# Altium project User_Interface.PrjPcb
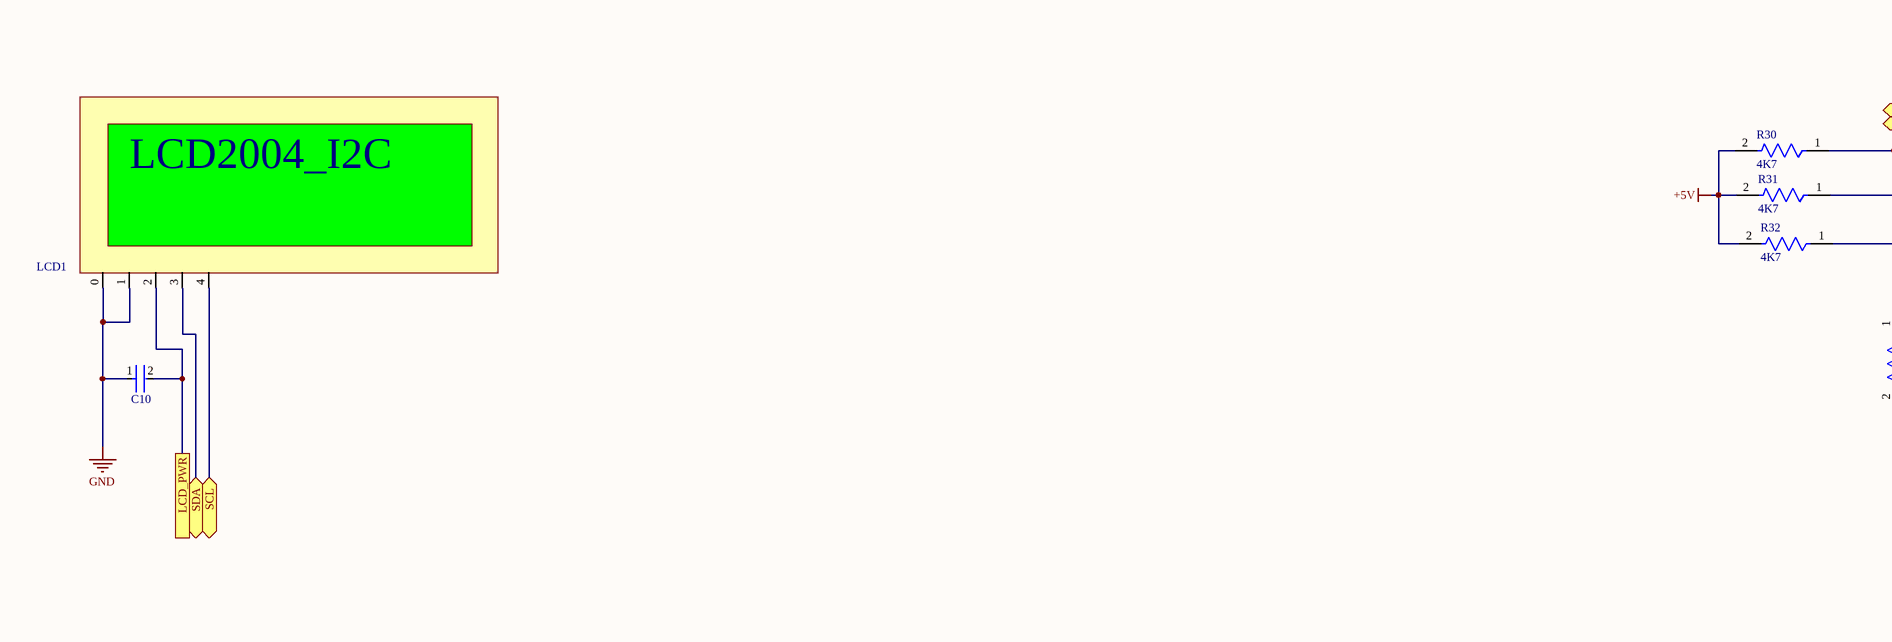
[diagram p0: User_Interface.SchDoc, top left]
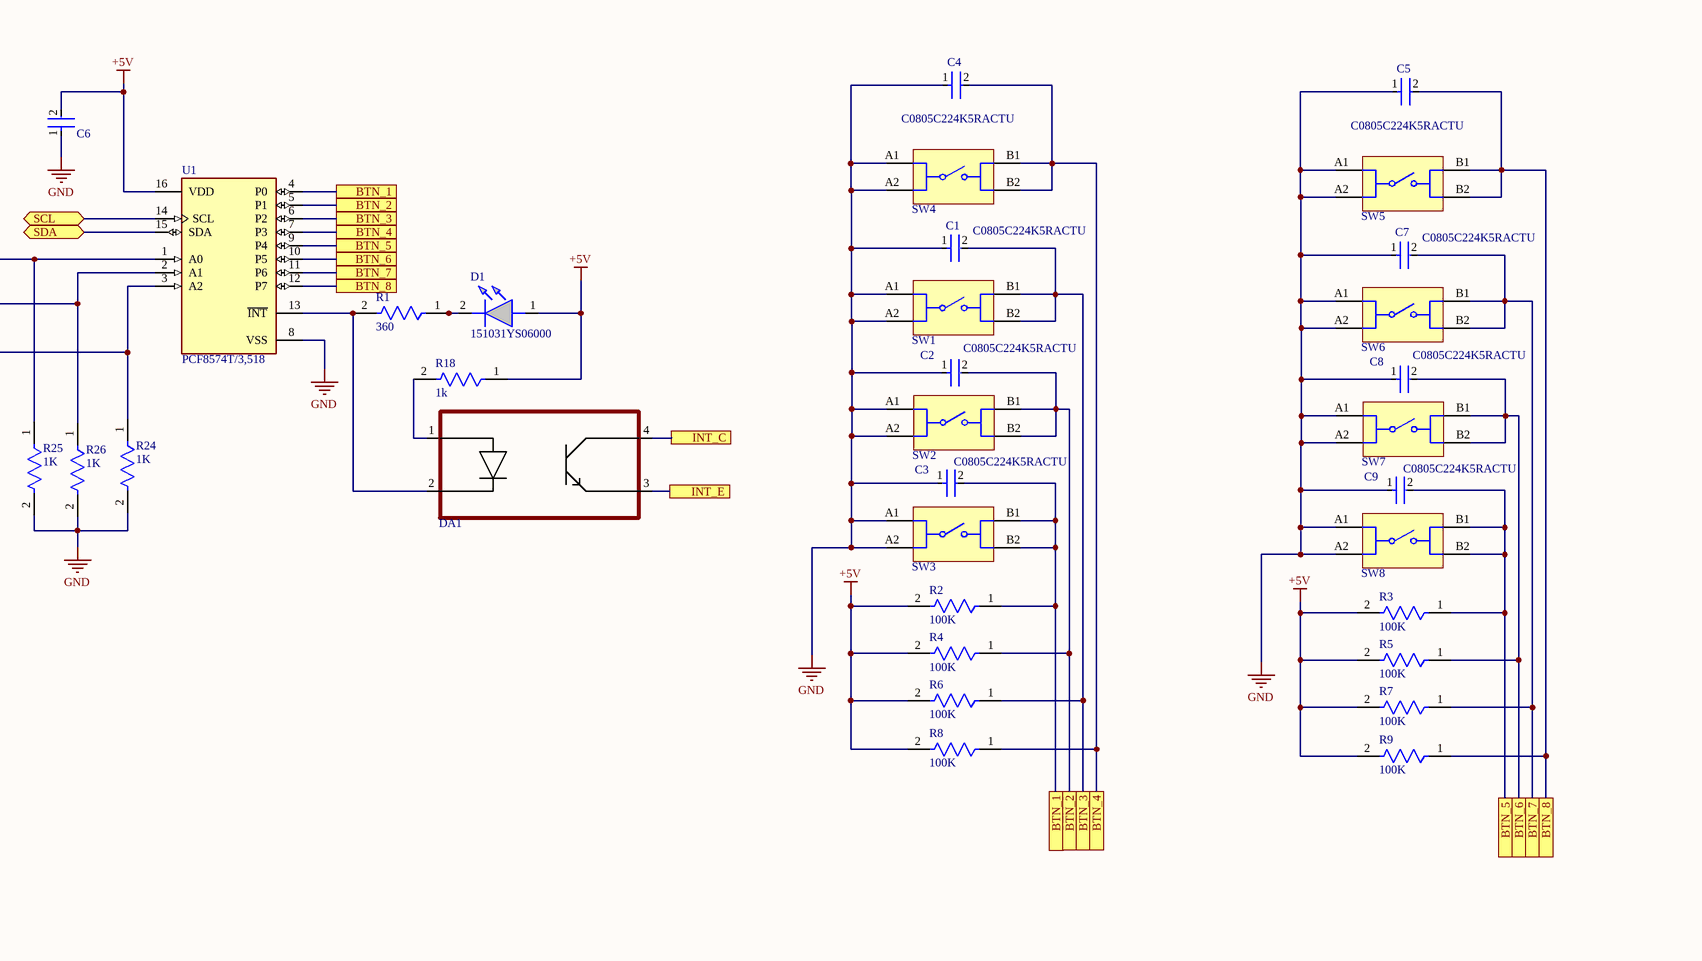
[diagram p1: User_Interface.SchDoc, top right]
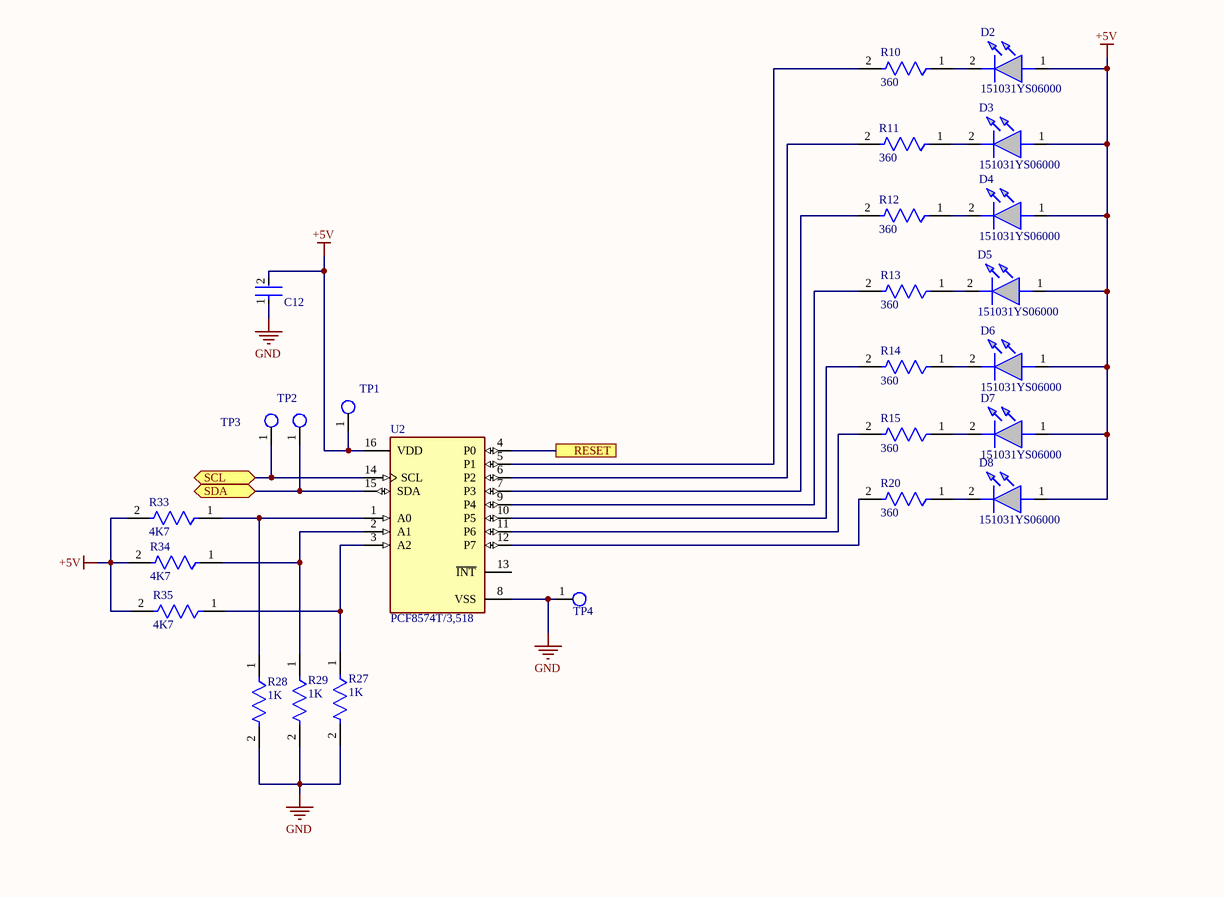
[diagram p2: User_Interface.SchDoc, bottom left]
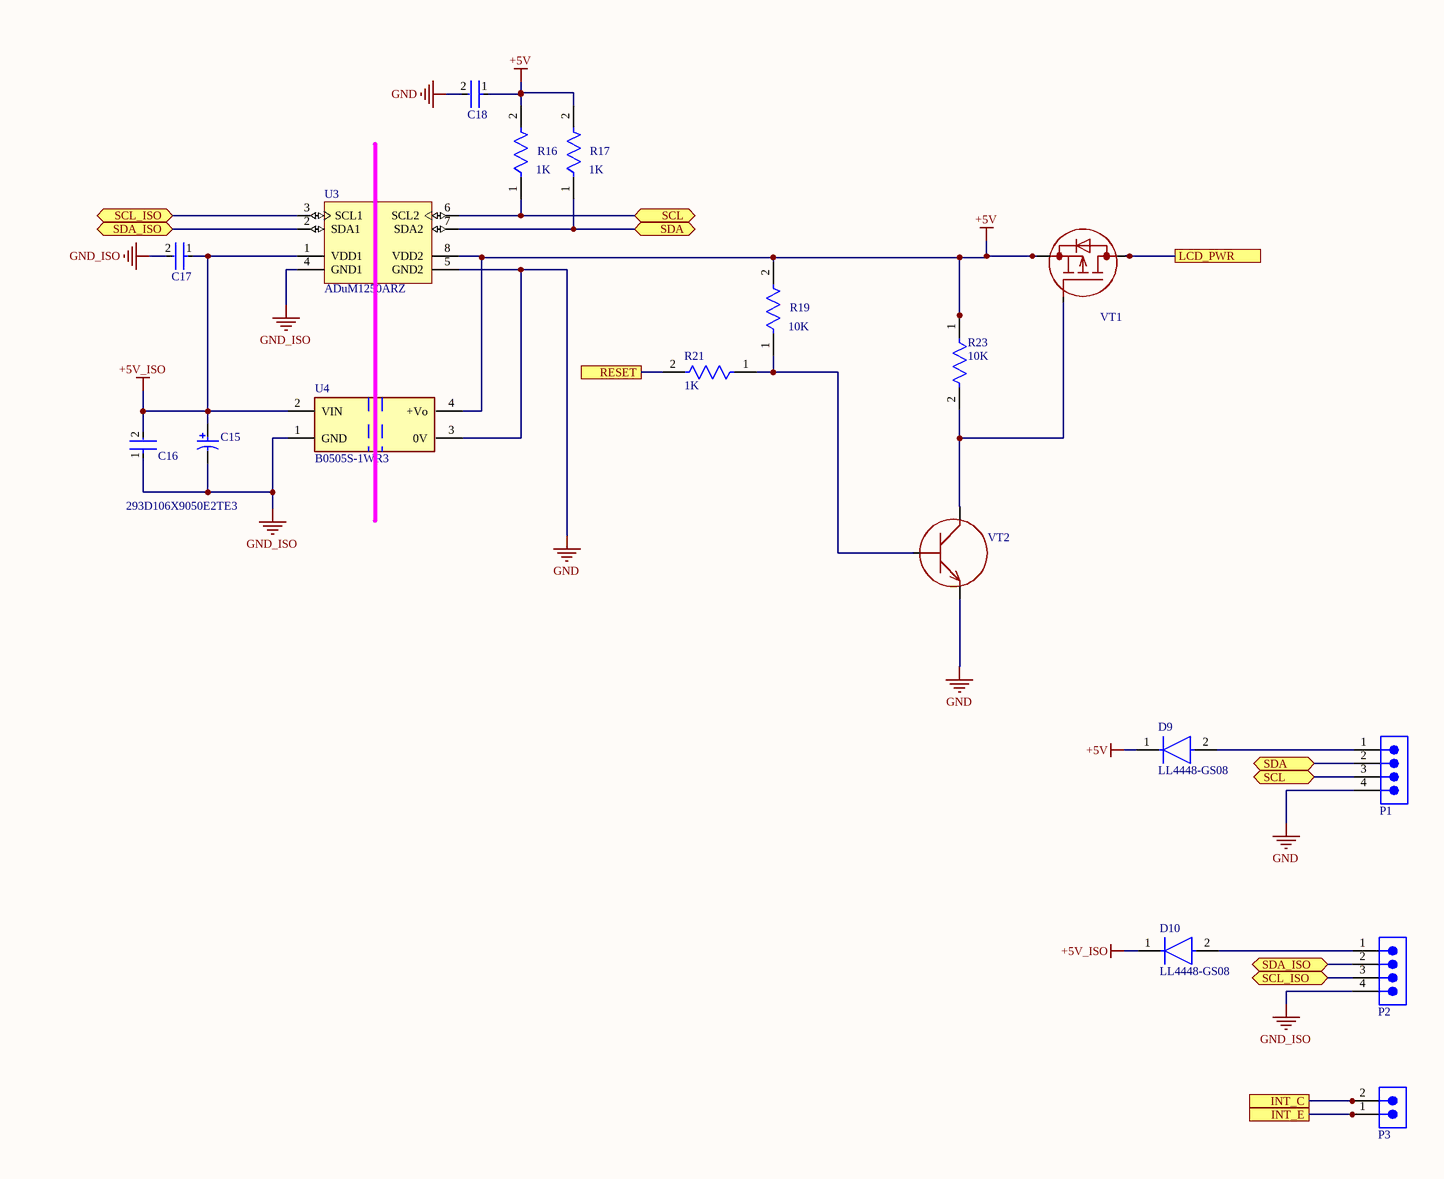
[diagram p3: User_Interface.SchDoc, bottom right]
1 sheet, 82 parts. Net scope: flat (ports and power ports of the same name join across sheets).
Board file: User_Interface.PcbDoc

## Sheet User_Interface.SchDoc
size A1; SheetNumber: 1; SheetTotal: 1

### Parts
C1  C0805C224K5RACTU  [FP-C0805C-DN-IPC_A]
C2  C0805C224K5RACTU  [FP-C0805C-DN-IPC_A]
C3  C0805C224K5RACTU  [FP-C0805C-DN-IPC_A]
C4  C0805C224K5RACTU  [FP-C0805C-DN-IPC_A]
C5  C0805C224K5RACTU  [FP-C0805C-DN-IPC_A]
C6  C0805C224K5RACTU  [FP-C0805C-DN-IPC_A]  (value not drawn)
C7  C0805C224K5RACTU  [FP-C0805C-DN-IPC_A]
C8  C0805C224K5RACTU  [FP-C0805C-DN-IPC_A]
C9  C0805C224K5RACTU  [FP-C0805C-DN-IPC_A]
C10  C0805C224K5RACTU  [FP-C0805C-DN-IPC_A]  (value not drawn)
C12  C0805C224K5RACTU  [FP-C0805C-DN-IPC_A]  (value not drawn)
C15  293D106X9050E2TE3  [VISH-293D-E_L]
C16  C0805C224K5RACTU  [FP-C0805C-DN-IPC_A]  (value not drawn)
C17  C0805C224K5RACTU  [FP-C0805C-DN-IPC_A]  (value not drawn)
C18  C0805C224K5RACTU  [FP-C0805C-DN-IPC_A]  (value not drawn)
D1  151031YS06000  [LED_BLUE]
D2  151031YS06000  [LED_GREEN]
D3  151031YS06000  [LED_GREEN]
D4  151031YS06000  [LED_GREEN]
D5  151031YS06000  [LED_GREEN]
D6  151031YS06000  [LED_GREEN]
D7  151031YS06000  [LED_GREEN]
D8  151031YS06000  [LED_GREEN]
D9  LL4448-GS08  [FP-6_560-5005_01-4-MFG]
D10  LL4448-GS08  [FP-6_560-5005_01-4-MFG]
DA1  PC817  [4-SMD]  (value not drawn)
LCD1  2004_I2C  [LCD2004_I2C]  (value not drawn)
P1  61900411021  [61900411021]  (value not drawn)
P2  61900411021  [61900411021]  (value not drawn)
P3  61900211021  [61900211021]  (value not drawn)
R1  360  [FP-CRCW0805-e3-MFG]
R2  100K  [FP-CRCW0805-e3-MFG]
R3  100K  [FP-CRCW0805-e3-MFG]
R4  100K  [FP-CRCW0805-e3-MFG]
R5  100K  [FP-CRCW0805-e3-MFG]
R6  100K  [FP-CRCW0805-e3-MFG]
R7  100K  [FP-CRCW0805-e3-MFG]
R8  100K  [FP-CRCW0805-e3-MFG]
R9  100K  [FP-CRCW0805-e3-MFG]
R10  360  [FP-CRCW0805-e3-MFG]
R11  360  [FP-CRCW0805-e3-MFG]
R12  360  [FP-CRCW0805-e3-MFG]
R13  360  [FP-CRCW0805-e3-MFG]
R14  360  [FP-CRCW0805-e3-MFG]
R15  360  [FP-CRCW0805-e3-MFG]
R16  1K  [Vishay_CRCW0805-e3_IPC_A]
R17  1K  [Vishay_CRCW0805-e3_IPC_A]
R18  1k  [FP-CRCW0805-e3-MFG]
R19  10K  [Vishay_CRCW0805-e3_IPC_A]
R20  360  [FP-CRCW0805-e3-MFG]
R21  1K  [Vishay_CRCW0805-e3_IPC_A]
R23  10K  [Vishay_CRCW0805-e3_IPC_A]
R24  1K  [Vishay_CRCW0805-e3_IPC_A]
R25  1K  [Vishay_CRCW0805-e3_IPC_A]
R26  1K  [Vishay_CRCW0805-e3_IPC_A]
R27  1K  [Vishay_CRCW0805-e3_IPC_A]
R28  1K  [Vishay_CRCW0805-e3_IPC_A]
R29  1K  [Vishay_CRCW0805-e3_IPC_A]
R30  4K7  [Vishay_CRCW0805-e3_IPC_A]
R31  4K7  [Vishay_CRCW0805-e3_IPC_A]
R32  4K7  [Vishay_CRCW0805-e3_IPC_A]
R33  4K7  [Vishay_CRCW0805-e3_IPC_A]
R34  4K7  [Vishay_CRCW0805-e3_IPC_A]
R35  4K7  [Vishay_CRCW0805-e3_IPC_A]
SW1  430156043726  [4301x60437x6]  (value not drawn)
SW2  430156043726  [4301x60437x6]  (value not drawn)
SW3  430156043726  [4301x60437x6]  (value not drawn)
SW4  430156043726  [4301x60437x6]  (value not drawn)
SW5  430156043726  [4301x60437x6]  (value not drawn)
SW6  430156043726  [4301x60437x6]  (value not drawn)
SW7  430156043726  [4301x60437x6]  (value not drawn)
SW8  430156043726  [4301x60437x6]  (value not drawn)
TP1  Test_Point_PCB  [Test_Point]  (value not drawn)
TP2  Test_Point_PCB  [Test_Point]  (value not drawn)
TP3  Test_Point_PCB  [Test_Point]  (value not drawn)
TP4  Test_Point_PCB  [Test_Point]  (value not drawn)
U1  PCF8574T/3,518  [FP-SOT162-1-MFG]
U2  PCF8574T/3,518  [FP-SOT162-1-MFG]
U3  ADuM1250ARZ  [ADI-R-8_N]
U4  B0505S-1WR3  [FP-B0505S-1WR3-MFG]
VT1  MOSFET-P-CH  [SOT23-3]  (value not drawn)
VT2  BC847-BEC  [SOT23-3]  (value not drawn)

### Ports
BTN_1, BTN_2, BTN_3, BTN_4, BTN_5, BTN_6, BTN_7, BTN_8, INT_C, INT_E, LCD_PWR, RESET, SCL (bidir), SCL_ISO (bidir), SDA (bidir), SDA_ISO (bidir)

### Nets
+5V: C6.2 C12.2 C18.1 D1.1(A) D2.1(A) D3.1(A) D4.1(A) D5.1(A) D6.1(A) D7.1(A) D8.1(A) D9.1(C) R2.2 R3.2 R4.2 R5.2 R6.2 R7.2 R8.2 R9.2 R16.2 R17.2 R18.1 R19.2 R23.1 R30.2 R31.2 R32.2 R33.2 R34.2 R35.2 TP1.1(G9) U1.16(VDD) U2.16(VDD) U3.8(VDD2) U4.4(+Vo) VT1.2(S)
+5V_ISO: C15.1 C16.2 C17.1 D10.1(C) U3.1(VDD1) U4.2(VIN)
GND: C1.1 C2.1 C3.1 C4.1 C5.1 C6.1 C7.1 C8.1 C9.1 C10.1 C12.1 C18.2 LCD1.0 LCD1.1 P1.4 R24.2 R25.2 R26.2 R27.2 R28.2 R29.2 SW1.A1 SW1.A2 SW2.A1 SW2.A2 SW3.A1 SW3.A2 SW4.A1 SW4.A2 SW5.A1 SW5.A2 SW6.A1 SW6.A2 SW7.A1 SW7.A2 SW8.A1 SW8.A2 TP4.1(G9) U1.8(VSS) U2.8(VSS) U3.5(GND2) U4.3(0V) VT2.2(E)
GND_ISO: C15.2 C16.1 C17.2 P2.4 U3.4(GND1) U4.1(GND)
NetC1_2: C1.2 R6.1 SW1.B1 SW1.B2 U1.6(P2) ; port BTN_3
NetC2_2: C2.2 R4.1 SW2.B1 SW2.B2 U1.5(P1) ; port BTN_2
NetC3_2: C3.2 R2.1 SW3.B1 SW3.B2 U1.4(P0) ; port BTN_1
NetC4_2: C4.2 R8.1 SW4.B1 SW4.B2 U1.7(P3) ; port BTN_4
NetC5_2: C5.2 R9.1 SW5.B1 SW5.B2 U1.12(P7) ; port BTN_8
NetC7_2: C7.2 R7.1 SW6.B1 SW6.B2 U1.11(P6) ; port BTN_7
NetC8_2: C8.2 R5.1 SW7.B1 SW7.B2 U1.10(P5) ; port BTN_6
NetC9_2: C9.2 R3.1 SW8.B1 SW8.B2 U1.9(P4) ; port BTN_5
NetC10_2: C10.2 LCD1.2 VT1.3(D) ; port LCD_PWR
NetD1_2: D1.2(K) R1.1
NetD2_2: D2.2(K) R10.1
NetD3_2: D3.2(K) R11.1
NetD4_2: D4.2(K) R12.1
NetD5_2: D5.2(K) R13.1
NetD6_2: D6.2(K) R14.1
NetD7_2: D7.2(K) R15.1
NetD8_2: D8.2(K) R20.1
NetD9_2: D9.2(A) P1.1
NetD10_2: D10.2(A) P2.1
NetDA1_1: DA1.1(ANODE) R18.2
NetDA1_2: DA1.2(CATHODE) R1.2 U1.13(~{INT})
NetDA1_3: DA1.3(EMITTER) P3.1 ; port INT_E
NetDA1_4: DA1.4(COLLECTOR) P3.2 ; port INT_C
NetLCD1_3: LCD1.3 P1.2 R17.1 TP2.1(G9) U1.15(SDA) U2.15(SDA) U3.7(SDA2) ; port SDA
NetLCD1_4: LCD1.4 P1.3 R16.1 TP3.1(G9) U1.14(SCL) U2.14(SCL) U3.6(SCL2) ; port SCL
NetP2_2: P2.2 U3.2(SDA1) ; port SDA_ISO
NetP2_3: P2.3 U3.3(SCL1) ; port SCL_ISO
NetR10_2: R10.2 U2.5(P1)
NetR11_2: R11.2 U2.6(P2)
NetR12_2: R12.2 U2.7(P3)
NetR13_2: R13.2 U2.9(P4)
NetR14_2: R14.2 U2.10(P5)
NetR15_2: R15.2 U2.11(P6)
NetR19_1: R19.1 R21.1 VT2.1(B)
NetR20_2: R20.2 U2.12(P7)
NetR21_2: R21.2 U2.4(P0) ; port RESET
NetR23_2: R23.2 VT1.1(G) VT2.3(C)
NetR24_1: R24.1 R32.1 U1.3(A2)
NetR25_1: R25.1 R30.1 U1.1(A0)
NetR26_1: R26.1 R31.1 U1.2(A1)
NetR27_1: R27.1 R35.1 U2.3(A2)
NetR28_1: R28.1 R33.1 U2.1(A0)
NetR29_1: R29.1 R34.1 U2.2(A1)

Not connected (* = marked no-connect by the designer): U2 13(~{INT})

### Library data of the parts
C1-C10 C12 C16-C18 = CMP-1036-04552-2: CAP CER 0.22UF 50V X7R 0805; Manufacturer: KEMET; Value: 0.22 μF; Temperature Coefficient: 30ppm/°C; Material: Ceramic; Tolerance: 0.1; ComponentLink2URL: https://content.kemet.com/datasheets/KEM_C1003_C0G_SMD.pdf; Temperature Characteristic: X7R; Device Class L3: Ceramic Capacitors; Lead Free: Yes; Temperature: -55°C to +125°C; RoHS: TRUE; Capacitance: 0.22 μF; Automotive: No; Octopart: https://octopart.com/c0805c224k5ractu-kemet-144670; Manufacturer Part Number: C0805C224K5RACTU; Temperature Range Low: -55°C; Height: 0.88mm; Device Class L1: Passive Components; Digikey Description: CAP CER 0.22UF 50V X7R 0805; ComponentLink2Description: Datasheet; Mouser Description: CAP CER 0.22UF 50V X7R 0805; Category: Cap; Ipc Land Pattern Name: CAPC200125X78; Temperature Range High: +125°C; Package: C0805C-DN; Device Class L2: Capacitors; Voltage Rating: 50 V
C15 = CMP-2000-05556-1: Tantalum Capacitor, 10 uF, +/- 10%, 50 V, -55 to 125 degC, 2-Pin SMD (7343-43), RoHS, Tape and Reel; Manufacturer: Vishay; Capacitance: 10000000pF; Product Height (mm): 4mm; Lead Spacing (nom): NotRequiredmm; Product Depth (mm): 4.3mm; Seal: NotRequired; Case Style: Molded; DELETED: Compliant; Voltage: 50VDC; Product Length (mm): 7.3mm; Polarity: Polar; ESR: 0.8ohm; DF: 6%; Rad Hardened: No; DCL: 5uA; Package Description: 2-Pin Surface Mount Device, Body 7.3 x 4.3 mm; Datasheet URL: http://www.vishay.com/docs/40002/293d.pdf; Operating Temp Range: -55Cto125C; Seated Plane Height: NotRequiredmm; Mounting Technology: SurfaceMount; Insulation: NotRequired; Failure Rate: NotRequired; Construction: SMTChip; Packaging: TapeandReel; Mounting Style: SurfaceMount; Tolerance (+ or -): 10%; Product Diameter (mm): NotRequiredmm; Length W/Weld (max): NotRequiredmm; Length W/Weld: NotRequiredmm; Case Code: E; Datasheet Version: 08/2016; Package Reference: 293D-E; Package / Case: 7343-43; Manufacturer URL: http://www.vishay.com/; Wire Form: NotRequired
D1-D8 = 151031YS06000: WURTH ELEKTRONIK - 151031YS06000 - LED, Yellow, Through Hole, T-1 (3mm), 30 mA, 2 V, 590 nm; Geometry.Height: 5.5mm; Manufacturer_Name: Wurth Elektronik; Manufacturer_Part_Number: 151031YS06000; Mouser Part Number: 710-151031YS06000; Mouser Price/Stock: https://www.mouser.co.uk/ProductDetail/Wurth-Elektronik/151031YS06000?qs=LlUlMxKIyB3xSYYW%252BcuBiQ%3D%3D; Arrow Part Number: *; Arrow Price/Stock: *; Mouser Testing Part Number: *; Mouser Testing Price/Stock: *; Datasheet Link: https://katalog.we-online.de/led/datasheet/151031YS06000.pdf
D9 D10 = CMP-249167-000001-1: DIODE GEN PURP 75V 150MA SOD80; Manufacturer: Vishay Small Signal; Max Junction Temp: +175°C; Automotive Grade: Grade 0; Capacitance: 4pF; Peak Reverse Current: 5uA; Forward Current: 300mA; Max Repetitive Reverse Voltage: 100V; Max Surge Forward Current: 2A; Value: 4pF; ComponentLink2Description: Datasheet; Height: 1.6mm; ComponentLink2URL: http://www.vishay.com/docs/85557/ll4148.pdf; Category: Diode; Lead Free: Yes; Device Class L3: Rectifier Diodes; Reverse Voltage: 75V; Mouser Description: Diodes - General Purpose, Power, Switching 100 Volt 100mA; RoHS: TRUE; Temperature: to +175°C; Automotive: Yes; Octopart: https://octopart.com/ll4448-gs08-vishay+small+signal-40886; Digikey Description: DIODE GEN PURP 75V 150MA SOD80; Manufacturer Part Number: LL4448-GS08; Temperature Range High: +175°C; Device Class L1: Discrete Semiconductors; Device Class L2: Diodes; Package: 6.560-5005.01-4
LCD1 = LCD2004_I2C
P1 P2 = 61900411021: WR-WTB THT Male Left Angled Bottom Locking Header, pitch 2.54mm, 4pins; Manufacturer: Wurth Elektronik; Contact Resistance: 20mΩ; Rated Current: 3A; Working Voltage: 250VAC; Withstanding Voltage: 1000VAC; ComponentLink1Description: Website Link; ComponentLink1URL: https://www.we-online.com/redexpert/article/61900411021?ad; ComponentLink2Description: Datasheet Link; ComponentLink2URL: https://www.we-online.com/redexpert/spec/61900411021?ad; Manufacturer Part Number: 61900411021; Category: Wire-to-Board Connectors; Match Code: WR-WTB; Mount: Through Hole; Operating Temperature Max: 105°C; Operating Temperature Min: -40°C; Packaging: Bag; Length: 10.16mm; Width: 12.47mm; Height: 5.8mm; Gender: Male; Number of Pins: 4; Number of Rows: 1; Orientation: Right Angled Bottom Locking; Pitch: 2.54mm
P3 = 61900211021: WR-WTB THT Male Left Angled Bottom Locking Header, pitch 2.54mm, 2pins; Manufacturer: Wurth Elektronik; Contact Resistance: 20mΩ; Rated Current: 3A; Working Voltage: 250VAC; Withstanding Voltage: 1000VAC; ComponentLink1Description: Website Link; ComponentLink1URL: https://www.we-online.com/redexpert/article/61900211021?ad; ComponentLink2Description: Datasheet Link; ComponentLink2URL: https://www.we-online.com/redexpert/spec/61900211021?ad; Manufacturer Part Number: 61900211021; Category: Wire-to-Board Connectors; Match Code: WR-WTB; Mount: Through Hole; Operating Temperature Max: 105°C; Operating Temperature Min: -40°C; Packaging: Bag; Length: 5.08mm; Width: 12.47mm; Height: 5.8mm; Gender: Male; Number of Pins: 2; Number of Rows: 1; Orientation: Right Angled Bottom Locking; Pitch: 2.54mm
R1 R10-R15 R18 R20 = CMP-2001-04908-2: RES Thick Film, 200Ω, 1%, 0.125W, 100ppm/°C, 0805; Resistance: 10kR; Voltage Rating (DC): 150V; Power Rating: 125mW; Weight: 0.000194oz; Package Quantity: 5000; Military Standard: Not; Max Operating Temperature: 155°C; Temperature Coefficient: 100ppm/°C; Contact Plating: Tin; Width: 1.25mm; Height: 0.45mm; Radiation Hardening: No; Tolerance: 1%; Min Operating Temperature: -55°C; Voltage Rating: 150V; Length: 2mm; Depth: 1.25mm; Termination: SMD/SMT; Packaging: Tape and Reel; Case/Package: 0805; Case Code (Metric): 2012; Lead Free: Lead Free; Case Code (Imperial): 0805; Composition: Thick Film
R2-R9 = CMP-2001-04908-2: RES Thick Film, 100kΩ, 1%, 0.125W, 100ppm/°C, 0805; Resistance: 10kR; Voltage Rating (DC): 150V; Power Rating: 125mW; Weight: 0.000194oz; Package Quantity: 5000; Military Standard: Not; Max Operating Temperature: 155°C; Temperature Coefficient: 100ppm/°C; Contact Plating: Tin; Width: 1.25mm; Height: 0.45mm; Radiation Hardening: No; Tolerance: 1%; Min Operating Temperature: -55°C; Voltage Rating: 150V; Length: 2mm; Depth: 1.25mm; Termination: SMD/SMT; Packaging: Tape and Reel; Case/Package: 0805; Case Code (Metric): 2012; Lead Free: Lead Free; Case Code (Imperial): 0805; Composition: Thick Film
R16 R17 R19 R21 R23-R35 = CRCW08050000Z0EA
SW1-SW8 = 430156043726: WS-TATV THT Tact Switch 6x6mm, SPST-NO, 12VDC, 50mA, 260g; Manufacturer: Wurth Elektronik; Washable: No; ComponentLink1Description: Website Link; ComponentLink1URL: https://www.we-online.com/redexpert/article/430156043726?ad; ComponentLink2Description: Datasheet Link; ComponentLink2URL: https://www.we-online.com/redexpert/spec/430156043726?ad; Manufacturer Part Number: 430156043726; Category: Tact Switches; Match Code: WS-TATV; Mount: Through Hole; Operating Temperature Max: 85°C; Operating Temperature Min: -40°C; Packaging: Bulk; Length: 6mm; Width: 6mm; Height: 4.3mm; Circuit: SPST-NO; Contact Material: Stainless Steel; Contact Plating: Silver; Operation Force: 260g; Rated Current: 50mA; Rated Voltage: 12VDC; Terminal Material: Copper Alloy; Terminal Plating: Silver
TP1-TP4 = TP_PCB?: Test_Point
U1 U2 = CMP-10112-000010-1: IC I/O EXPANDER I2C 8B 16SOIC; Manufacturer: NXP Semiconductors; Frequency: 100kHz; Max Supply Voltage: 6V; Standoff Height: 0.1mm; Nominal Supply Current: 40uA; Max Junction Temp: +125°C; Min Supply Voltage: 2.5V; Number Of I/Os: 8; Manufacturer Part Number: PCF8574T/3,518; Footprint Url: https://www.nxp.com/docs/en/package-information/SOT162-1.pdf; ComponentLink2URL: https://www.nxp.com/docs/en/data-sheet/PCF8574_PCF8574A.pdf; Automotive: No; Digikey Description: IC I/O EXPANDER I2C 8B 16SOIC; Mouser Description: PCF8574 Series 2.5 - 6V Remote 8-bit I/O Expander for I2C-bus - SOIC-16; Ipc Land Pattern Name: SOIC127P1032X265-16; Interface: I2C; Octopart: https://octopart.com/pcf8574t%2F3%2C518-nxp+semiconductors-10470852; Ambient Temperature Range Low: -40°C; Lead Free: Yes; Device Class L2: Interface ICs; Temperature Range High: +85°C; Device Class L1: Integrated Circuits (ICs); Package: SOT162-1; ComponentLink2Description: Datasheet; Device Class L3: I/O Expanders; Temperature: -40°C to +85°C; Ambient Temperature Range High: +85°C; Height: 2.65mm; Category: IC; RoHS: TRUE; Temperature Range Low: -40°C
U3 = CMP-0534-00654-1: Hot Swappable, Dual I2C Isolator, 3 to 5.5 V, -40 to 105 degC, 8-Pin SOIC (R-8), RoHS, Tube; Data Rate: 1 Mbps; Supply Voltage Max: 5.5 V; Supply Voltage Min: 3 V; ComponentLink1Description: Manufacturer URL; Mounting Technology: Surface Mount; RoHS: TRUE; ComponentLink2URL: http://www.analog.com/media/en/technical-documentation/data-sheets/ADUM1250_1251.pdf; Temperature Min: -40 degC; Generic Part Number: ADUM1250; PackageDescription: 8-Pin Small Outline Package, Body 4.9 x 3.9 mm, Pitch 1.27 mm; Temperature Max: 105 degC; ComponentLink1URL: http://www.analog.com/; Packing: Tube; DatasheetVersion: Rev. H; Code_JEDEC: MS-012-AA; PartNumber: ADuM1250ARZ; ComponentLink2Description: Datasheet
U4 = B0505s-1W: DC DC Converter 5V 1W